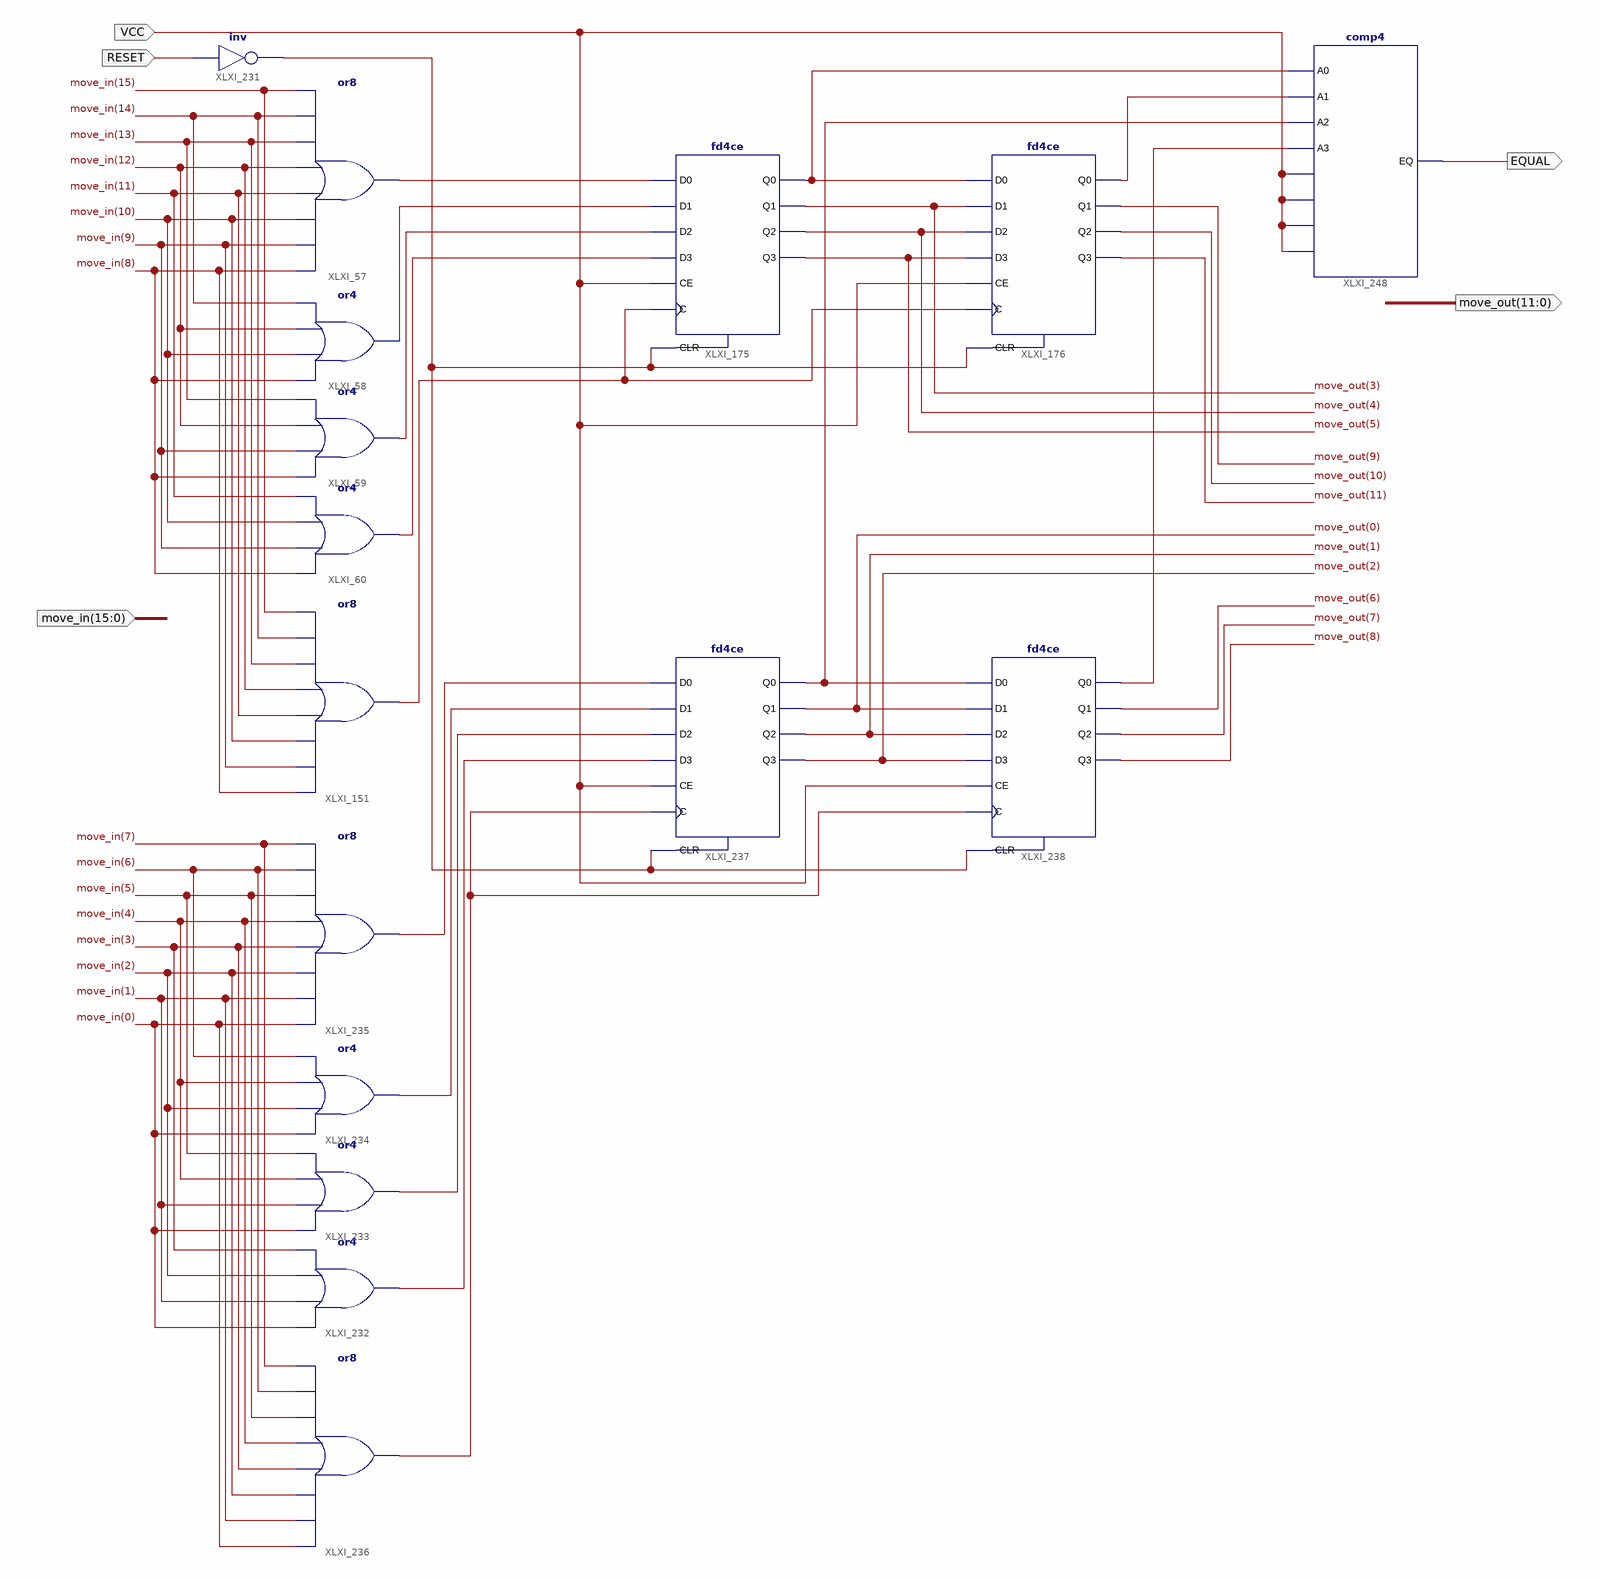
[diagram p0: schematic sheet 1]
// Xilinx ISE schematic switch_move_input.sch (spartan6) as structural Verilog: 16 symbols, 5 ports
module switch_move_input (
  input  RESET,
  input  VCC,
  input  [15:0] move_in,
  output EQUAL,
  output [11:0] move_out
);

  wire comp_1, comp_2, comp_3, comp_4, XLXN_352, XLXN_353, XLXN_354, XLXN_355, XLXN_360, XLXN_511, XLXN_519,
       XLXN_521, XLXN_522, XLXN_523, XLXN_526;

  or XLXI_60 (XLXN_355, move_in[8], move_in[9], move_in[10], move_in[11]);
  or XLXI_59 (XLXN_354, move_in[8], move_in[9], move_in[12], move_in[13]);
  or XLXI_58 (XLXN_353, move_in[8], move_in[10], move_in[12], move_in[14]);
  or XLXI_57 (XLXN_352, move_in[8], move_in[9], move_in[10], move_in[11], move_in[12], move_in[13], move_in[14], move_in[15]);
  or XLXI_151 (XLXN_360, move_in[8], move_in[9], move_in[10], move_in[11], move_in[12], move_in[13], move_in[14], move_in[15]);
  fd4ce XLXI_175 (
    .C(XLXN_360), .CE(VCC), .CLR(XLXN_519), .D0(XLXN_352), .D1(XLXN_353), .D2(XLXN_354), .D3(XLXN_355),
    .Q0(comp_1), .Q1(move_out[3]), .Q2(move_out[4]), .Q3(move_out[5]));
  fd4ce XLXI_176 (
    .C(XLXN_360), .CE(VCC), .CLR(XLXN_519), .D0(comp_1), .D1(move_out[3]), .D2(move_out[4]),
    .D3(move_out[5]), .Q0(comp_2), .Q1(move_out[9]), .Q2(move_out[10]), .Q3(move_out[11]));
  not XLXI_231 (XLXN_519, RESET);
  or XLXI_232 (XLXN_523, move_in[0], move_in[1], move_in[2], move_in[3]);
  or XLXI_233 (XLXN_522, move_in[0], move_in[1], move_in[4], move_in[5]);
  or XLXI_234 (XLXN_521, move_in[0], move_in[2], move_in[4], move_in[6]);
  or XLXI_235 (XLXN_511, move_in[0], move_in[1], move_in[2], move_in[3], move_in[4], move_in[5], move_in[6], move_in[7]);
  or XLXI_236 (XLXN_526, move_in[0], move_in[1], move_in[2], move_in[3], move_in[4], move_in[5], move_in[6], move_in[7]);
  fd4ce XLXI_238 (
    .C(XLXN_526), .CE(VCC), .CLR(XLXN_519), .D0(comp_3), .D1(move_out[0]), .D2(move_out[1]),
    .D3(move_out[2]), .Q0(comp_4), .Q1(move_out[6]), .Q2(move_out[7]), .Q3(move_out[8]));
  fd4ce XLXI_237 (
    .C(XLXN_526), .CE(VCC), .CLR(XLXN_519), .D0(XLXN_511), .D1(XLXN_521), .D2(XLXN_522), .D3(XLXN_523),
    .Q0(comp_3), .Q1(move_out[0]), .Q2(move_out[1]), .Q3(move_out[2]));
  comp4 XLXI_248 (
    .A0(comp_1), .A1(comp_2), .A2(comp_3), .A3(comp_4), .B0(VCC), .B1(VCC), .B2(VCC), .B3(VCC), .EQ(EQUAL));
endmodule
